# Altium schematic sheet RelayCard.SchDoc: Relay Control Module
size Tabloid; Date: 03/13/2023; Engineer: Terry D. Schevker; Revision: 1.0; SheetNumber: 1; SheetTotal: 2
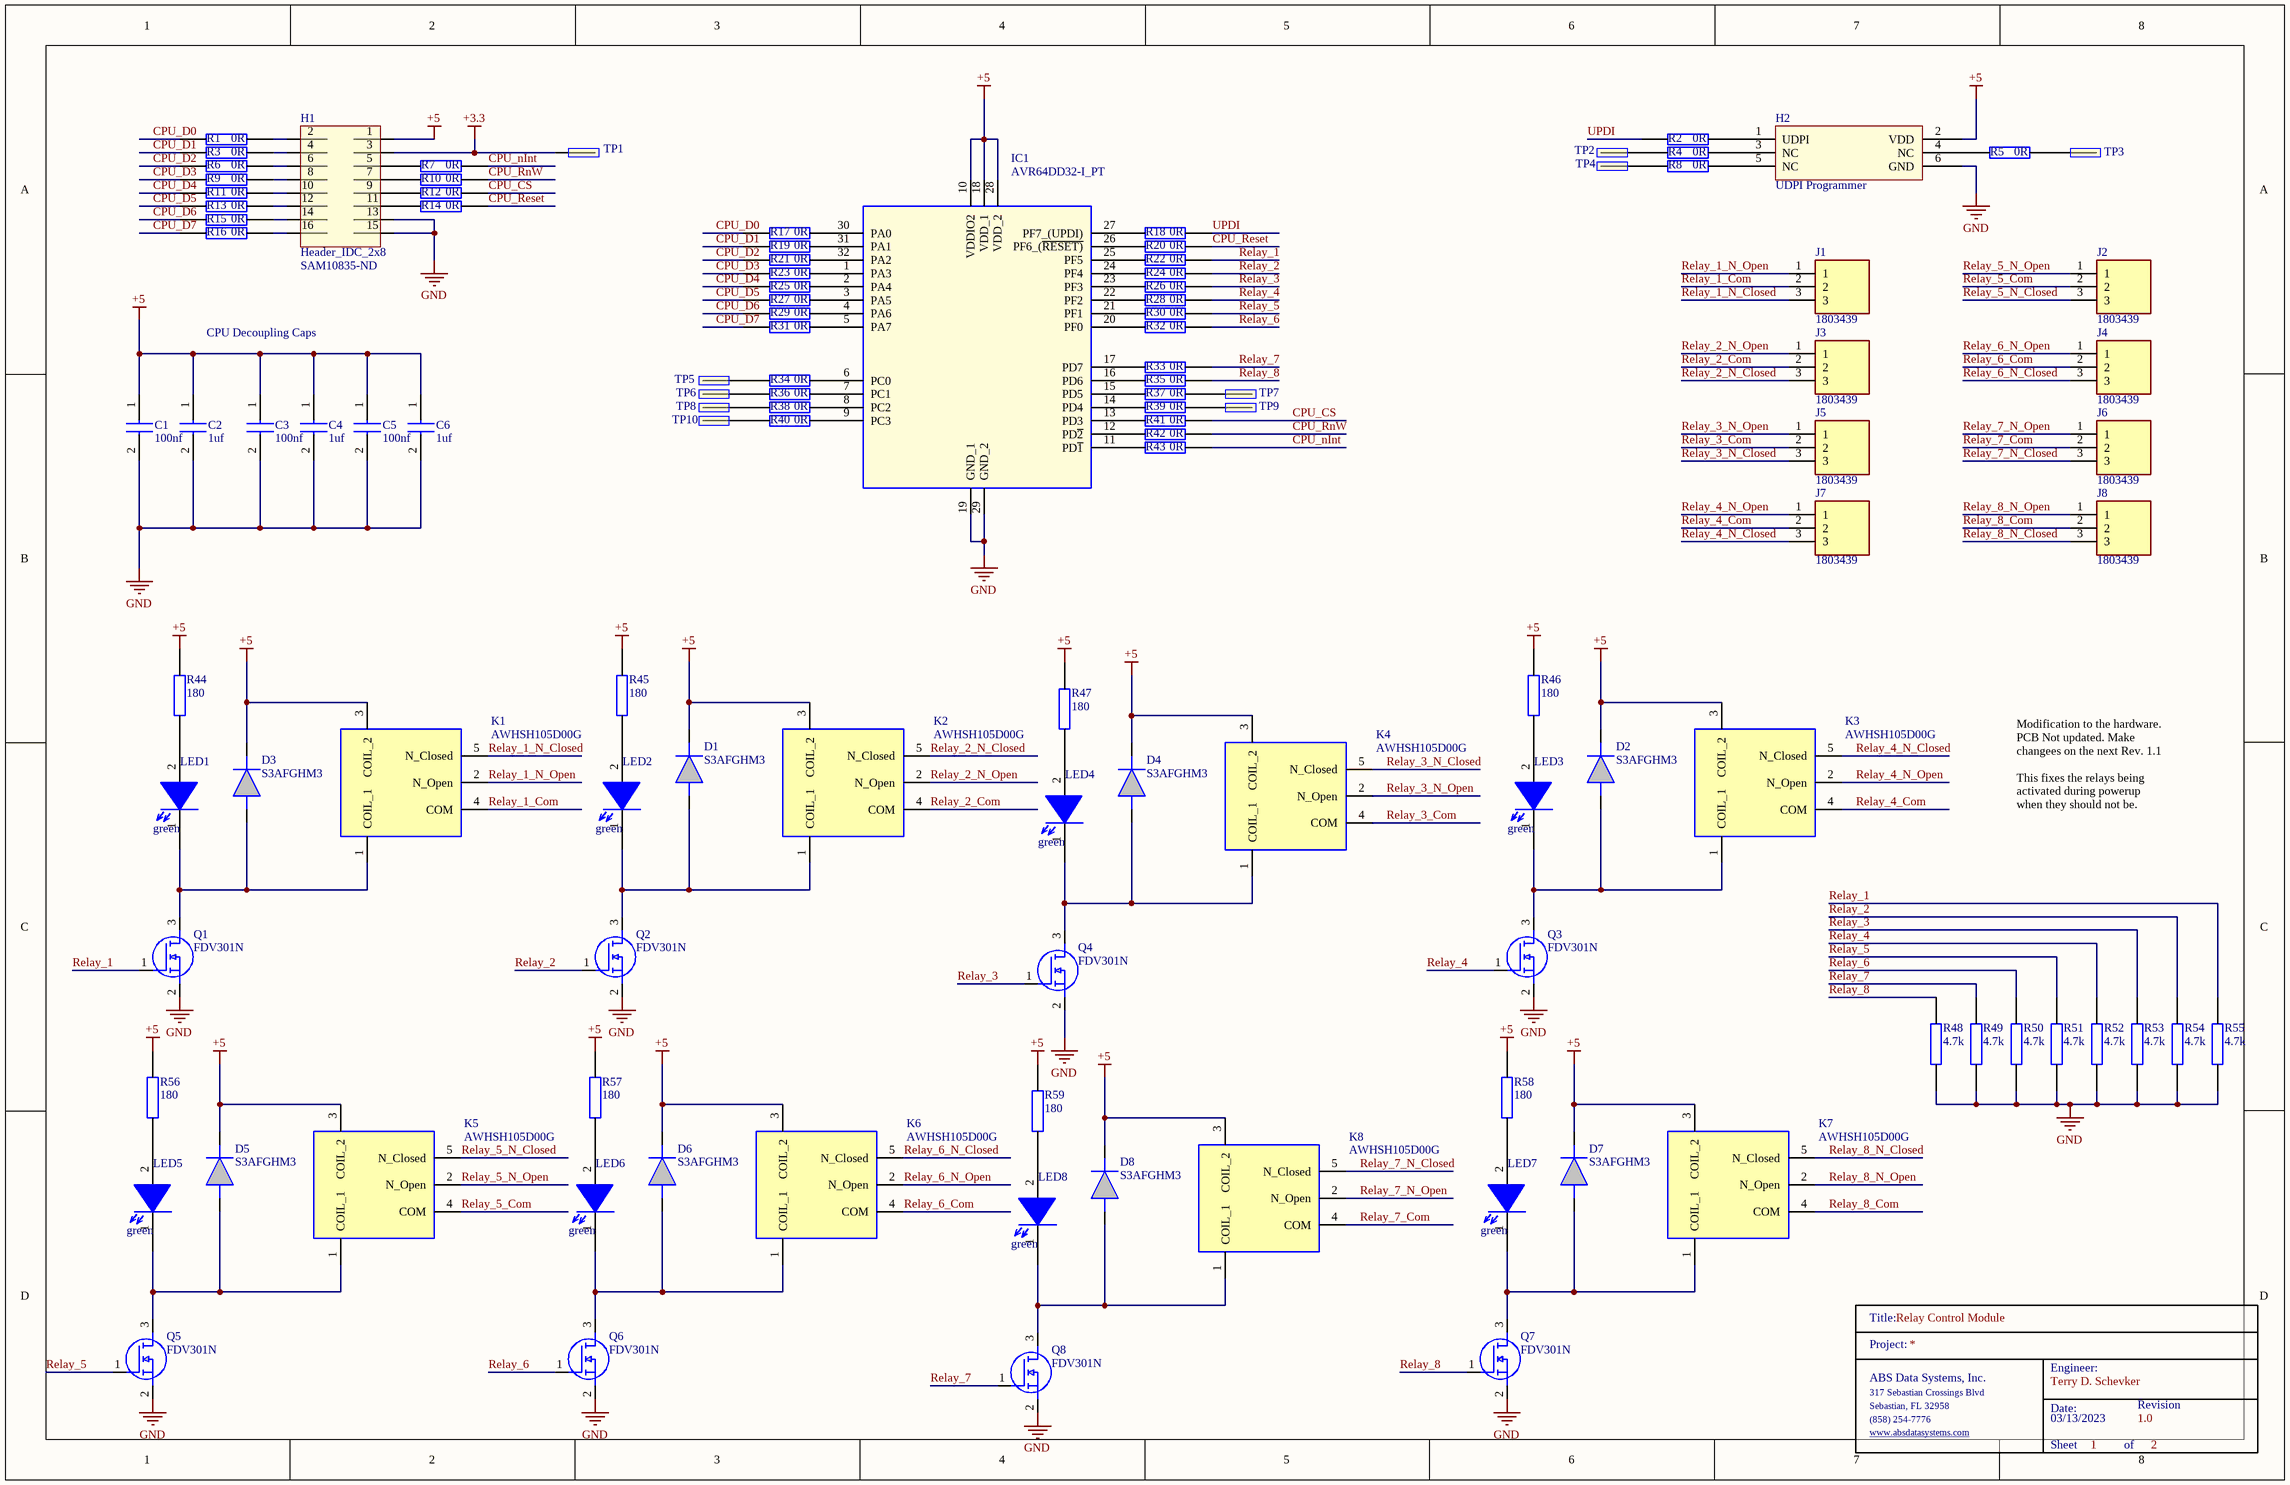
[diagram p0: RelayCard.SchDoc]

## Parts
C1  100nf  [0603]
C2  1uf  [0603]
C3  100nf  [0603]
C4  1uf  [0603]
C5  100nf  [0603]
C6  1uf  [0603]
D1  S3AFGHM3  [DO-221AC]
D2  S3AFGHM3  [DO-221AC]
D3  S3AFGHM3  [DO-221AC]
D4  S3AFGHM3  [DO-221AC]
D5  S3AFGHM3  [DO-221AC]
D6  S3AFGHM3  [DO-221AC]
D7  S3AFGHM3  [DO-221AC]
D8  S3AFGHM3  [DO-221AC]
H1  Header_IDC_2x8  Supplier Part Number 1: SAM10835-ND  [HEADER16]
H2  UDPI Programmer  [HDR2X3]
IC1  AVR64DD32-I_PT  [QFP80P900X900X120-32N]
J1  1803439  [1803439]
J2  1803439  [1803439]
J3  1803439  [1803439]
J4  1803439  [1803439]
J5  1803439  [1803439]
J6  1803439  [1803439]
J7  1803439  [1803439]
J8  1803439  [1803439]
K1  AWHSH105D00G  [AWHSH105D00G]
K2  AWHSH105D00G  [AWHSH105D00G]
K3  AWHSH105D00G  [AWHSH105D00G]
K4  AWHSH105D00G  [AWHSH105D00G]
K5  AWHSH105D00G  [AWHSH105D00G]
K6  AWHSH105D00G  [AWHSH105D00G]
K7  AWHSH105D00G  [AWHSH105D00G]
K8  AWHSH105D00G  [AWHSH105D00G]
LED1  green  [0603_Diode]
LED2  green  [0603_Diode]
LED3  green  [0603_Diode]
LED4  green  [0603_Diode]
LED5  green  [0603_Diode]
LED6  green  [0603_Diode]
LED7  green  [0603_Diode]
LED8  green  [0603_Diode]
Q1  FDV301N  [SOT96P237X111-3N]
Q2  FDV301N  [SOT96P237X111-3N]
Q3  FDV301N  [SOT96P237X111-3N]
Q4  FDV301N  [SOT96P237X111-3N]
Q5  FDV301N  [SOT96P237X111-3N]
Q6  FDV301N  [SOT96P237X111-3N]
Q7  FDV301N  [SOT96P237X111-3N]
Q8  FDV301N  [SOT96P237X111-3N]
R1  0R  [0603]
R2  0R  [0603]
R3  0R  [0603]
R4  0R  [0603]
R5  0R  [0603]
R6  0R  [0603]
R7  0R  [0603]
R8  0R  [0603]
R9  0R  [0603]
R10  0R  [0603]
R11  0R  [0603]
R12  0R  [0603]
R13  0R  [0603]
R14  0R  [0603]
R15  0R  [0603]
R16  0R  [0603]
R17  0R  [0603]
R18  0R  [0603]
R19  0R  [0603]
R20  0R  [0603]
R21  0R  [0603]
R22  0R  [0603]
R23  0R  [0603]
R24  0R  [0603]
R25  0R  [0603]
R26  0R  [0603]
R27  0R  [0603]
R28  0R  [0603]
R29  0R  [0603]
R30  0R  [0603]
R31  0R  [0603]
R32  0R  [0603]
R33  0R  [0603]
R34  0R  [0603]
R35  0R  [0603]
R36  0R  [0603]
R37  0R  [0603]
R38  0R  [0603]
R39  0R  [0603]
R40  0R  [0603]
R41  0R  [0603]
R42  0R  [0603]
R43  0R  [0603]
R44  180  [0603]
R45  180  [0603]
R46  180  [0603]
R47  180  [0603]
R48  4.7k  [0603]
R49  4.7k  [0603]
R50  4.7k  [0603]
R51  4.7k  [0603]
R52  4.7k  [0603]
R53  4.7k  [0603]
R54  4.7k  [0603]
R55  4.7k  [0603]
R56  180  [0603]
R57  180  [0603]
R58  180  [0603]
R59  180  [0603]
TitleBlock_1  TitleBlock  (value not drawn)  (graphical)
TP1  TP  [TP]  (value not drawn)
TP2  TP  [TP]  (value not drawn)
TP3  TP  [TP]  (value not drawn)
TP4  TP  [TP]  (value not drawn)
TP5  TP  [TP]  (value not drawn)
TP6  TP  [TP]  (value not drawn)
TP7  TP  [TP]  (value not drawn)
TP8  TP  [TP]  (value not drawn)
TP9  TP  [TP]  (value not drawn)
TP10  TP  [TP]  (value not drawn)

## Nets
+3.3: H1.3 TP1.1
+5: C1.1 C2.1 C3.1 C4.1 C5.1 C6.1 D1.1(K) D2.1(K) D3.1(K) D4.1(K) D5.1(K) D6.1(K) D7.1(K) D8.1(K) H1.1 H2.2(VDD) IC1.10(VDDIO2) IC1.18(VDD_1) IC1.28(VDD_2) K1.3(COIL_2) K2.3(COIL_2) K3.3(COIL_2) K4.3(COIL_2) K5.3(COIL_2) K6.3(COIL_2) K7.3(COIL_2) K8.3(COIL_2) R44.2 R45.2 R46.2 R47.2 R56.2 R57.2 R58.2 R59.2
GND: C1.2 C2.2 C3.2 C4.2 C5.2 C6.2 H1.13 H1.15 H2.6(GND) IC1.19(GND_1) IC1.29(GND_2) Q1.2(S) Q2.2(S) Q3.2(S) Q4.2(S) Q5.2(S) Q6.2(S) Q7.2(S) Q8.2(S) R48.2 R49.2 R50.2 R51.2 R52.2 R53.2 R54.2 R55.2
CPU_CS: R12.2 R41.2
CPU_D0: R1.1 R17.1
CPU_D1: R3.1 R19.1
CPU_D2: R6.1 R21.1
CPU_D3: R9.1 R23.1
CPU_D4: R11.1 R25.1
CPU_D5: R13.1 R27.1
CPU_D6: R15.1 R29.1
CPU_D7: R16.1 R31.1
CPU_nInt: R7.2 R43.2
CPU_Reset: R14.2 R20.2
CPU_RnW: R10.2 R42.2
Relay_1: Q1.1(G) R22.2 R55.1
Relay_1_Com: J1.2 K1.4(COM)
Relay_1_N_Closed: J1.3 K1.5(N_Closed)
Relay_1_N_Open: J1.1 K1.2(N_Open)
Relay_2: Q2.1(G) R24.2 R54.1
Relay_2_Com: J3.2 K2.4(COM)
Relay_2_N_Closed: J3.3 K2.5(N_Closed)
Relay_2_N_Open: J3.1 K2.2(N_Open)
Relay_3: Q4.1(G) R26.2 R53.1
Relay_3_Com: J5.2 K4.4(COM)
Relay_3_N_Closed: J5.3 K4.5(N_Closed)
Relay_3_N_Open: J5.1 K4.2(N_Open)
Relay_4: Q3.1(G) R28.2 R52.1
Relay_4_Com: J7.2 K3.4(COM)
Relay_4_N_Closed: J7.3 K3.5(N_Closed)
Relay_4_N_Open: J7.1 K3.2(N_Open)
Relay_5: Q5.1(G) R30.2 R51.1
Relay_5_Com: J2.2 K5.4(COM)
Relay_5_N_Closed: J2.3 K5.5(N_Closed)
Relay_5_N_Open: J2.1 K5.2(N_Open)
Relay_6: Q6.1(G) R32.2 R50.1
Relay_6_Com: J4.2 K6.4(COM)
Relay_6_N_Closed: J4.3 K6.5(N_Closed)
Relay_6_N_Open: J4.1 K6.2(N_Open)
Relay_7: Q8.1(G) R33.2 R49.1
Relay_7_Com: J6.2 K8.4(COM)
Relay_7_N_Closed: J6.3 K8.5(N_Closed)
Relay_7_N_Open: J6.1 K8.2(N_Open)
Relay_8: Q7.1(G) R35.2 R48.1
Relay_8_Com: J8.2 K7.4(COM)
Relay_8_N_Closed: J8.3 K7.5(N_Closed)
Relay_8_N_Open: J8.1 K7.2(N_Open)
UPDI: R2.1 R18.2
NetD1_2: D1.2(A) K2.1(COIL_1) LED2.1(K) Q2.3(D)
NetD2_2: D2.2(A) K3.1(COIL_1) LED3.1(K) Q3.3(D)
NetD3_2: D3.2(A) K1.1(COIL_1) LED1.1(K) Q1.3(D)
NetD4_2: D4.2(A) K4.1(COIL_1) LED4.1(K) Q4.3(D)
NetD5_2: D5.2(A) K5.1(COIL_1) LED5.1(K) Q5.3(D)
NetD6_2: D6.2(A) K6.1(COIL_1) LED6.1(K) Q6.3(D)
NetD7_2: D7.2(A) K7.1(COIL_1) LED7.1(K) Q7.3(D)
NetD8_2: D8.2(A) K8.1(COIL_1) LED8.1(K) Q8.3(D)
NetH1_2: H1.2 R1.2
NetH1_4: H1.4 R3.2
NetH1_5: H1.5 R7.1
NetH1_6: H1.6 R6.2
NetH1_7: H1.7 R10.1
NetH1_8: H1.8 R9.2
NetH1_9: H1.9 R12.1
NetH1_10: H1.10 R11.2
NetH1_11: H1.11 R14.1
NetH1_12: H1.12 R13.2
NetH1_14: H1.14 R15.2
NetH1_16: H1.16 R16.2
NetH2_1: H2.1(UDPI) R2.2
NetH2_3: H2.3(NC) R4.2
NetH2_4: H2.4(NC) R5.1
NetH2_5: H2.5(NC) R8.2
NetIC1_1: IC1.1(PA3) R23.2
NetIC1_2: IC1.2(PA4) R25.2
NetIC1_3: IC1.3(PA5) R27.2
NetIC1_4: IC1.4(PA6) R29.2
NetIC1_5: IC1.5(PA7) R31.2
NetIC1_6: IC1.6(PC0) R34.2
NetIC1_7: IC1.7(PC1) R36.2
NetIC1_8: IC1.8(PC2) R38.2
NetIC1_9: IC1.9(PC3) R40.2
NetIC1_11: IC1.11(PD~{1}) R43.1
NetIC1_12: IC1.12(PD~{2}) R42.1
NetIC1_13: IC1.13(PD3) R41.1
NetIC1_14: IC1.14(PD4) R39.1
NetIC1_15: IC1.15(PD5) R37.1
NetIC1_16: IC1.16(PD6) R35.1
NetIC1_17: IC1.17(PD7) R33.1
NetIC1_20: IC1.20(PF0) R32.1
NetIC1_21: IC1.21(PF1) R30.1
NetIC1_22: IC1.22(PF2) R28.1
NetIC1_23: IC1.23(PF3) R26.1
NetIC1_24: IC1.24(PF4) R24.1
NetIC1_25: IC1.25(PF5) R22.1
NetIC1_26: IC1.26(PF6_(~{RESET)}) R20.1
NetIC1_27: IC1.27(PF7_(UPDI)) R18.1
NetIC1_30: IC1.30(PA0) R17.2
NetIC1_31: IC1.31(PA1) R19.2
NetIC1_32: IC1.32(PA2) R21.2
NetLED1_2: LED1.2(A) R44.1
NetLED2_2: LED2.2(A) R45.1
NetLED3_2: LED3.2(A) R46.1
NetLED4_2: LED4.2(A) R47.1
NetLED5_2: LED5.2(A) R56.1
NetLED6_2: LED6.2(A) R57.1
NetLED7_2: LED7.2(A) R58.1
NetLED8_2: LED8.2(A) R59.1
NetR4_1: R4.1 TP2.1
NetR5_2: R5.2 TP3.1
NetR8_1: R8.1 TP4.1
NetR34_1: R34.1 TP5.1
NetR36_1: R36.1 TP6.1
NetR37_2: R37.2 TP7.1
NetR38_1: R38.1 TP8.1
NetR39_2: R39.2 TP9.1
NetR40_1: R40.1 TP10.1

## Notes on the sheet
- CPU Decoupling Caps
- Modification to the hardware.
  PCB Not updated. Make changees on the next Rev. 1.1
  This fixes the relays being activated during powerup when they should not be.
- (in symbol TitleBlock) Title:; Project:; Engineer:; ABS Data Systems, Inc.; 317 Sebastian Crossings Blvd; Sebastian, FL 32958; Date:; Revision; (858) 254-7776; www.absdatasystems.com; Sheet; of

## Library data of the parts
C1 C3 C5 = CL10B104JB8NNNC: Samsung Electro-Mechanics 0603 100nf
C2 C4 C6 = CL10B105KA8NNNL: Samsung Electro-Mechanics 0603 1uf
D1-D8 = S3AFGHM3/I: Rectifiers VR=400V, IO=3A; Manufacturer_Name: Comchip Technology; Manufacturer_Part_Number: 1N4001-G; Mouser Part Number: 750-1N4001-G; Mouser Price/Stock: https://www.mouser.co.uk/ProductDetail/Comchip-Technology/1N4001-G?qs=2qJf6qQ4IOKJYZQUWvVExw%3D%3D; Datasheet Link: https://datasheet.datasheetarchive.com/originals/distributors/Datasheets-7/DSA-138621.pdf
H1 = Header_IDC_2x8: 16 Pin 2x8 Through Hold IDC Connector; Manufacturer: Samtec; Manufacturer Part Number: TST-108-01-G-D; Number of Contacts: 16; Gender: Male; Connector Type: Male Pin; Pitch: 2.54mm; Row Spacing: 0.1inch; Supplier 1: Digi-Key; RoHS: Yes; Category: Headers and Wire Housings; Stock 1: 227; Pricing 1: 1=2.85000, 10=2.73600, 100=2.28000, 500=1.93800, 1000=1.65300, 5000=1.48200 (USD); Mount: Through Hole; Contact Plating: Gold; Contact Material: Bronze; Housing Material: Polyester; Housing Color: Black; Color: Black; Min Operating Temperature: -55°C; Max Operating Temperature: 125°C; Number of Rows: 2; Termination: Solder; Packaging: Rail/Tube; Orientation: Straight; Number of Positions: 16; Length: 27.94mm; Depth: 9.27mm; Contact Mating Length: 0.25inch; REACH SVHC: No SVHC; ComponentLink1URL: https://datasheet.ciiva.com/739/tst-mkt-739845.pdf?src-supplier=Digi-Key; ComponentLink1Description: https://datasheet.ciiva.com/739/tst-mkt-739845.pdf?src-supplier=Digi-Key; ComponentLink2URL: https://datasheet.ciiva.com/10018/htst-10018510.pdf?src-supplier=Avnet; ComponentLink2Description: https://datasheet.ciiva.com/10018/htst-10018510.pdf?src-supplier=Avnet
H2 = UDPI Programmer: 6 Pin 2X3 Through Hole Header
IC1 = AVR64DD32-I_PT: Integrated Circuit; Manufacturer_Name: Microchip; Manufacturer_Part_Number: AVR64DD32-I/PT | MULTI-VOLTAGE I/O; Datasheet Link: https://www.microchip.com/en-us/product/AVR64DD32; Height: 1.2mm
J1-J8 = 1803439: Connector; Manufacturer_Name: Phoenix Contact; Datasheet Link: http://uk.rs-online.com/web/p/products/2204838; Manufacturer_Part_Number: 1803439; Mouser Part Number: 651-1803439; Mouser Price/Stock: https://www.mouser.co.uk/ProductDetail/Phoenix-Contact/1803439?qs=ChwaSN6Xm4%2FKqu7eZUAe4w%3D%3D; Arrow Part Number: 1803439; Arrow Price/Stock: https://www.arrow.com/en/products/1803439/phoenix-contact?region=nac
K1-K8 = AWHSH105D00G: General Purpose Relays Commercial RelayRated Carrying Current :15AType of Sealing : Sealed and Waterproof TypeNumber of pole : one poleCoil Voltage : 5VCoil Type : Standard DC CoilContact Form : Form C; Manufacturer_Name: Amphenol; Geometry.Height: 15.3mm; Mouser Part Number: 523-AWHSH105D00G; Mouser Price/Stock: https://www.mouser.co.uk/ProductDetail/Amphenol-Anytek/AWHSH105D00G?qs=rSMjJ%252B1ewcT7jFUGTuCYSw%3D%3D; Manufacturer_Part_Number: AWHSH105D00G; Datasheet Link: http://www.anytek.com.cn/AWHSH112DM00G-15121582407.pdf
LED1-LED8 = 150060GS75000: Wurth Elektronik 0603 green; Manufacturer: Wurth Electronics; Wavelength: 520nm; Viewing Angle: 140°; Lens Style: Clear,Rectangular; Luminous Intensity: 430mcd; Forward Current: 30mA; Forward Voltage: 3.2V; Test Current: 20mA; Supplier 1: Digi-Key; Manufacturer Part Number: 150060GS75000; RoHS: Yes; Category: LEDs; Stock 1: 71509; Pricing 1: 1=0.14000, 50=0.13300, 100=0.11400, 500=0.09900 (USD); Mount: Surface Mount; Case/Package: 0603; Color: Green; Case Code (Metric): 1608; Case Code (Imperial): 0603; Min Operating Temperature: -40°C; Max Operating Temperature: 85°C; Package Quantity: 4000; Packaging: Tape and Reel; Dominant Wavelength: 520nm; Length: 1.6mm; Width: 0.8mm; Height: 0.7mm; REACH SVHC: Unknown; Lead Free: Lead Free; ComponentLink1URL: https://datasheet.ciiva.com/29562/150060gs75000-29562868.pdf?src-supplier=Digi-Key; ComponentLink1Description: https://datasheet.ciiva.com/29562/150060gs75000-29562868.pdf?src-supplier=Digi-Key; ComponentLink2URL: https://datasheet.ciiva.com/29279/759427-da-01-en-chipled-0603-w-kl-gruen-150060gs75000-29279201.pdf?src-supplier=Conrad; ComponentLink2Description: https://datasheet.ciiva.com/29279/759427-da-01-en-chipled-0603-w-kl-gruen-150060gs75000-29279201.pdf?src-supplier=Conrad; ComponentLink3URL: https://datasheet.ciiva.com/29562/150060gs75000-29562869.pdf?src-supplier=Digi-Key; ComponentLink3Description: https://datasheet.ciiva.com/29562/150060gs75000-29562869.pdf?src-supplier=Digi-Key; ComponentLink4URL: https://datasheet.ciiva.com/29562/150060gs75000-29562870.pdf?src-supplier=Digi-Key; ComponentLink4Description: https://datasheet.ciiva.com/29562/150060gs75000-29562870.pdf?src-supplier=Digi-Key
Q1-Q8 = FDV301N: MOSFET N-Channel 25V 0.5A SOT23 Fairchild FDV301N N-channel MOSFET Transistor, 0.22 A, 25 V, 3-Pin SOT-23; Manufacturer_Name: onsemi; Geometry.Height: 1.11mm; Mouser Part Number: 512-FDV301N; Mouser Price/Stock: https://www.mouser.co.uk/ProductDetail/onsemi-Fairchild/FDV301N?qs=HK%252BeIG1iaahv7gPT5tsFJQ%3D%3D; Manufacturer_Part_Number: FDV301N; Datasheet Link: https://datasheet.datasheetarchive.com/originals/distributors/Datasheets_SAMA/0cce9550595c1a9ba17b856c55fee955.pdf
R1-R43 = RC0603JR-070RL: YAGEO 0603 0 ohm; Manufacturer_Name: KEMET; Geometry.Height: 0.55mm; Mouser Part Number: 603-RC0603JR-070RL; Mouser Price/Stock: https://www.mouser.co.uk/ProductDetail/YAGEO/RC0603JR-070RL?qs=2cAdsCoAWRGWyPcuXgGiXQ%3D%3D; Manufacturer_Part_Number: RC0603JR-070RL; Datasheet Link: https://datasheet.datasheetarchive.com/originals/distributors/Datasheets_SAMA/902f9e387b938f871d31120f5fc1d65e.pdf
R44-R47 R56-R59 = RC0603FR-13180RL: YAGEO 0603 180 ohm; Manufacturer_Name: KEMET; Manufacturer_Part_Number: RC0603JR-070RL; Geometry.Height: 0.55mm; Mouser Part Number: 603-RC0603JR-070RL; Mouser Price/Stock: https://www.mouser.co.uk/ProductDetail/YAGEO/RC0603JR-070RL?qs=2cAdsCoAWRGWyPcuXgGiXQ%3D%3D; Datasheet Link: https://datasheet.datasheetarchive.com/originals/distributors/Datasheets_SAMA/902f9e387b938f871d31120f5fc1d65e.pdf
R48-R55 = RC0603FR-104K7L: YAGEO 0603 4.7k; Manufacturer_Name: KEMET; Manufacturer_Part_Number: RC0603JR-070RL; Geometry.Height: 0.55mm; Mouser Part Number: 603-RC0603JR-070RL; Mouser Price/Stock: https://www.mouser.co.uk/ProductDetail/YAGEO/RC0603JR-070RL?qs=2cAdsCoAWRGWyPcuXgGiXQ%3D%3D; Datasheet Link: https://datasheet.datasheetarchive.com/originals/distributors/Datasheets_SAMA/902f9e387b938f871d31120f5fc1d65e.pdf
TP1-TP10 = TP: Manufacturer: Samtec; Manufacturer Part Number: TST-105-01-G-D; Number of Contacts: 16; Gender: Male; Connector Type: Male Pin; Pitch: 2.54mm; Row Spacing: 0.1inch; Supplier 1: Digi-Key; RoHS: Yes; Category: Headers and Wire Housings; Stock 1: 227; Pricing 1: 1=2.85000, 10=2.73600, 100=2.28000, 500=1.93800, 1000=1.65300, 5000=1.48200 (USD); Mount: Through Hole; Contact Plating: Gold; Contact Material: Bronze; Housing Material: Polyester; Housing Color: Black; Color: Black; Min Operating Temperature: -55°C; Max Operating Temperature: 125°C; Number of Rows: 2; Termination: Solder; Packaging: Rail/Tube; Orientation: Straight; Number of Positions: 16; Length: 27.94mm; Depth: 9.27mm; Contact Mating Length: 0.25inch; REACH SVHC: No SVHC; ComponentLink1URL: https://datasheet.ciiva.com/739/tst-mkt-739845.pdf?src-supplier=Digi-Key; ComponentLink1Description: https://datasheet.ciiva.com/739/tst-mkt-739845.pdf?src-supplier=Digi-Key; ComponentLink2URL: https://datasheet.ciiva.com/10018/htst-10018510.pdf?src-supplier=Avnet; ComponentLink2Description: https://datasheet.ciiva.com/10018/htst-10018510.pdf?src-supplier=Avnet